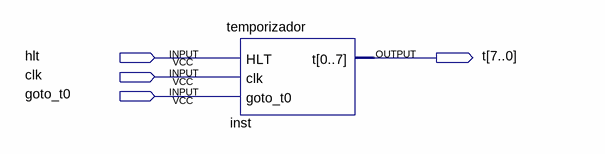
[diagram p0: schematic sheet]
// Quartus schematic teste_temporizador.bdf as structural Verilog: 1 symbols, 4 pins
module teste_temporizador (
  input  hlt,
  input  clk,
  input  goto_t0,
  output [7:0] t
);

  temporizador inst (.HLT(hlt), .clk(clk), .goto_t0(goto_t0), .t(t));
endmodule
